# Altium schematic sheet ext_supply_con.SchDoc
size A3; SheetNumber: 13; SheetTotal: 15; SheetDescription: External Supply Connectors
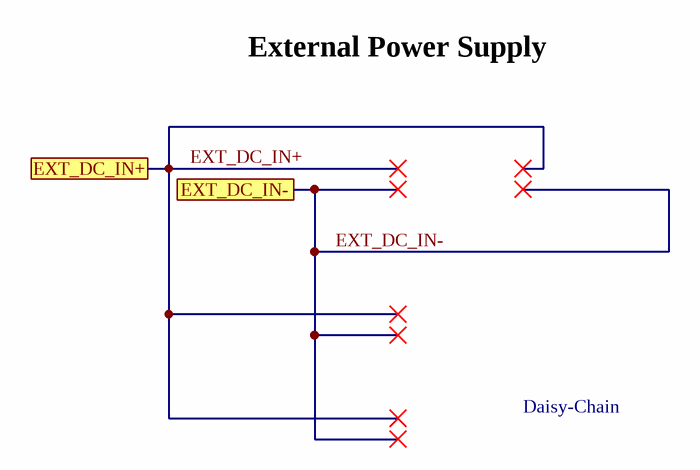
[diagram p0: ext_supply_con.SchDoc]

## Ports
EXT_DC_IN+, EXT_DC_IN-

## Nets
EXT_DC_IN+: port EXT_DC_IN+
EXT_DC_IN-: port EXT_DC_IN-

## Notes on the sheet
- External Power Supply
- Daisy-Chain
- Fraunhofer IISB
- Schottkystr. 10
- developed by:
- 91058 Erlangen
- Germany
- Author
- Project
- License
- Description
- File
- Version
- Release Date
- Sheet
- foxbms.org <https://foxbms.org>
- www.iisb.fraunhofer.de <https://www.iisb.fraunhofer.de/>
- foxBMS Team
- /